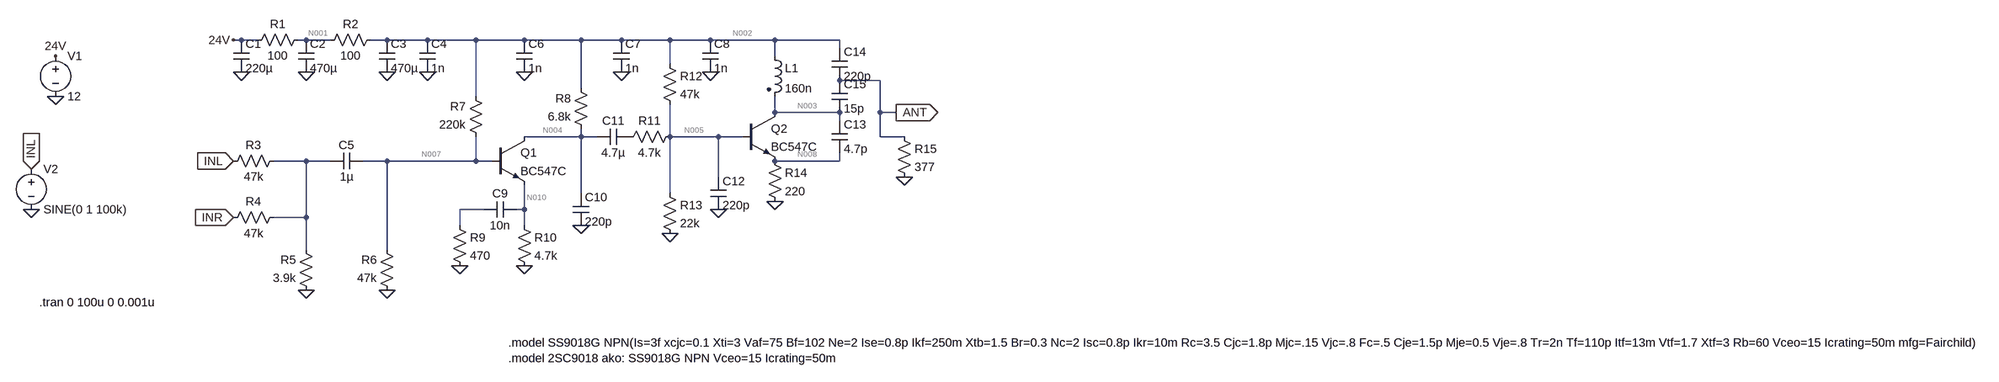
[diagram p0: schematic Sender.asc]
Sender.asc, the LTspice schematic file:
Version 4
SHEET 1 4164 740
WIRE 384 96 368 96
WIRE 416 96 384 96
WIRE 512 96 496 96
WIRE 560 96 512 96
WIRE 672 96 640 96
WIRE 752 96 672 96
WIRE 848 96 752 96
WIRE 944 96 848 96
WIRE 1056 96 944 96
WIRE 1136 96 1056 96
WIRE 1232 96 1136 96
WIRE 1312 96 1232 96
WIRE 1440 96 1312 96
WIRE 1568 96 1440 96
WIRE 1568 112 1568 96
WIRE 1440 128 1440 96
WIRE 1232 144 1232 96
WIRE 1648 176 1568 176
WIRE 1056 192 1056 96
WIRE 848 208 848 96
WIRE 1440 240 1440 208
WIRE 1568 240 1440 240
WIRE 1648 240 1648 176
WIRE 1680 240 1648 240
WIRE 1568 256 1568 240
WIRE 1056 288 1056 272
WIRE 1056 288 944 288
WIRE 1088 288 1056 288
WIRE 1232 288 1232 224
WIRE 1328 288 1232 288
WIRE 1376 288 1328 288
WIRE 1648 288 1648 240
WIRE 1696 288 1648 288
WIRE 512 336 448 336
WIRE 560 336 512 336
WIRE 672 336 624 336
WIRE 848 336 848 288
WIRE 848 336 672 336
WIRE 880 336 848 336
WIRE 1568 336 1568 320
WIRE 1568 336 1440 336
WIRE 1328 368 1328 288
WIRE 1056 400 1056 288
WIRE 1232 400 1232 288
WIRE 864 432 816 432
WIRE 944 432 944 384
WIRE 944 432 928 432
WIRE 512 448 512 336
WIRE 512 448 448 448
WIRE 816 464 816 432
WIRE 944 464 944 432
WIRE 512 512 512 448
WIRE 672 512 672 336
FLAG 16 208 0
FLAG 16 128 24V
FLAG 368 96 24V
FLAG 384 160 0
FLAG 512 160 0
FLAG 672 160 0
FLAG 752 160 0
FLAG 368 336 INL
IOPIN 368 336 In
FLAG 368 448 INR
IOPIN 368 448 In
FLAG 512 592 0
FLAG 672 592 0
FLAG 816 544 0
FLAG 944 544 0
FLAG 1056 464 0
FLAG 944 160 0
FLAG 1136 160 0
FLAG 1312 160 0
FLAG 1232 480 0
FLAG 1328 432 0
FLAG 1440 416 0
FLAG 1680 240 ANT
IOPIN 1680 240 Out
FLAG -32 352 INL
IOPIN -32 352 In
FLAG -32 432 0
FLAG 1696 368 0
SYMBOL voltage 16 112 R0
WINDOW 123 0 0 Left 0
WINDOW 39 0 0 Left 0
SYMATTR InstName V1
SYMATTR Value 12
SYMBOL res 512 80 R90
WINDOW 0 0 56 VBottom 2
WINDOW 3 32 56 VTop 2
SYMATTR InstName R1
SYMATTR Value 100
SYMBOL cap 368 96 R0
SYMATTR InstName C1
SYMATTR Value 220µ
SYMBOL res 656 80 R90
WINDOW 0 0 56 VBottom 2
WINDOW 3 32 56 VTop 2
SYMATTR InstName R2
SYMATTR Value 100
SYMBOL cap 496 96 R0
SYMATTR InstName C2
SYMATTR Value 470µ
SYMBOL cap 656 96 R0
SYMATTR InstName C3
SYMATTR Value 470µ
SYMBOL cap 736 96 R0
SYMATTR InstName C4
SYMATTR Value 1n
SYMBOL res 464 320 R90
WINDOW 0 0 56 VBottom 2
WINDOW 3 32 56 VTop 2
SYMATTR InstName R3
SYMATTR Value 47k
SYMBOL res 464 432 R90
WINDOW 0 0 56 VBottom 2
WINDOW 3 32 56 VTop 2
SYMATTR InstName R4
SYMATTR Value 47k
SYMBOL res 528 608 R180
WINDOW 0 36 76 Left 2
WINDOW 3 36 40 Left 2
SYMATTR InstName R5
SYMATTR Value 3.9k
SYMBOL res 688 608 R180
WINDOW 0 36 76 Left 2
WINDOW 3 36 40 Left 2
SYMATTR InstName R6
SYMATTR Value 47k
SYMBOL res 864 304 R180
WINDOW 0 36 76 Left 2
WINDOW 3 36 40 Left 2
SYMATTR InstName R7
SYMATTR Value 220k
SYMBOL cap 624 320 R90
WINDOW 0 0 32 VBottom 2
WINDOW 3 32 32 VTop 2
SYMATTR InstName C5
SYMATTR Value 1µ
SYMBOL npn 880 288 R0
SYMATTR InstName Q1
SYMATTR Value BC547C
SYMBOL cap 928 96 R0
SYMATTR InstName C6
SYMATTR Value 1n
SYMBOL cap 1120 96 R0
SYMATTR InstName C7
SYMATTR Value 1n
SYMBOL cap 1296 96 R0
SYMATTR InstName C8
SYMATTR Value 1n
SYMBOL res 1072 288 R180
WINDOW 0 36 76 Left 2
WINDOW 3 36 40 Left 2
SYMATTR InstName R8
SYMATTR Value 6.8k
SYMBOL res 800 448 R0
SYMATTR InstName R9
SYMATTR Value 470
SYMBOL res 928 448 R0
SYMATTR InstName R10
SYMATTR Value 4.7k
SYMBOL cap 864 448 R270
WINDOW 0 32 32 VTop 2
WINDOW 3 0 32 VBottom 2
SYMATTR InstName C9
SYMATTR Value 10n
SYMBOL cap 1040 400 R0
SYMATTR InstName C10
SYMATTR Value 220p
SYMBOL cap 1152 272 R90
WINDOW 0 0 32 VBottom 2
WINDOW 3 32 32 VTop 2
SYMATTR InstName C11
SYMATTR Value 4.7µ
SYMBOL res 1248 272 R90
WINDOW 0 0 56 VBottom 2
WINDOW 3 32 56 VTop 2
SYMATTR InstName R11
SYMATTR Value 4.7k
SYMBOL res 1216 128 R0
SYMATTR InstName R12
SYMATTR Value 47k
SYMBOL res 1216 384 R0
SYMATTR InstName R13
SYMATTR Value 22k
SYMBOL cap 1312 368 R0
SYMATTR InstName C12
SYMATTR Value 220p
SYMBOL npn 1376 240 R0
SYMATTR InstName Q2
SYMATTR Value BC547C
SYMBOL res 1424 320 R0
SYMATTR InstName R14
SYMATTR Value 220
SYMBOL cap 1552 256 R0
SYMATTR InstName C13
SYMATTR Value 4.7p
SYMBOL cap 1552 112 R0
SYMATTR InstName C14
SYMATTR Value 220p
SYMBOL cap 1552 176 R0
SYMATTR InstName C15
SYMATTR Value 15p
SYMBOL ind2 1424 112 R0
SYMATTR InstName L1
SYMATTR Value 160n
SYMATTR Type ind
SYMATTR SpiceLine Rser=2
SYMBOL voltage -32 336 R0
WINDOW 123 0 0 Left 0
WINDOW 39 0 0 Left 0
SYMATTR InstName V2
SYMATTR Value SINE(0 1 100k)
SYMBOL res 1680 272 R0
SYMATTR InstName R15
SYMATTR Value 377
TEXT -16 616 Left 2 !.tran 0 100u 0 0.001u
TEXT 912 696 Left 2 !.model SS9018G NPN(Is=3f xcjc=0.1 Xti=3 Vaf=75 Bf=102 Ne=2 Ise=0.8p Ikf=250m Xtb=1.5 Br=0.3 Nc=2 Isc=0.8p Ikr=10m Rc=3.5 Cjc=1.8p Mjc=.15 Vjc=.8 Fc=.5 Cje=1.5p Mje=0.5 Vje=.8 Tr=2n Tf=110p Itf=13m Vtf=1.7 Xtf=3 Rb=60 Vceo=15 Icrating=50m mfg=Fairchild)\n.model 2SC9018 ako: SS9018G NPN Vceo=15 Icrating=50m

The netlist it stands for:
* Sender.asc
V1 24V 0 12
R1 N001 24V 100
C1 24V 0 220µ
R2 N002 N001 100
C2 N001 0 470µ
C3 N002 0 470µ
C4 N002 0 1n
R3 N006 INL 47k
R4 N006 INR 47k
R5 0 N006 3.9k
R6 0 N007 47k
R7 N007 N002 220k
C5 N007 N006 1µ
Q1 N004 N007 N010 0 BC547C
C6 N002 0 1n
C7 N002 0 1n
C8 N002 0 1n
R8 N004 N002 6.8k
R9 N009 0 470
R10 N010 0 4.7k
C9 N009 N010 10n
C10 N004 0 220p
C11 P001 N004 4.7µ
R11 N005 P001 4.7k
R12 N002 N005 47k
R13 N005 0 22k
C12 N005 0 220p
Q2 N003 N005 N008 0 BC547C
R14 N008 0 220
C13 N003 N008 4.7p
C14 N002 ANT 220p
C15 ANT N003 15p
L1 N002 N003 160n Rser=2
V2 INL 0 SINE(0 1 100k)
R15 ANT 0 377
.model NPN NPN
.model PNP PNP
.lib standard.bjt
.tran 0 100u 0 0.001u
.model SS9018G NPN(Is=3f xcjc=0.1 Xti=3 Vaf=75 Bf=102 Ne=2 Ise=0.8p Ikf=250m Xtb=1.5 Br=0.3 Nc=2 Isc=0.8p Ikr=10m Rc=3.5 Cjc=1.8p Mjc=.15 Vjc=.8 Fc=.5 Cje=1.5p Mje=0.5 Vje=.8 Tr=2n Tf=110p Itf=13m Vtf=1.7 Xtf=3 Rb=60 Vceo=15 Icrating=50m mfg=Fairchild)
.model 2SC9018 ako: SS9018G NPN Vceo=15 Icrating=50m
.backanno
.end

* Results of the author's LTspice run, read from the files saved beside the schematic
* Operating Point, zero values left out:
*   V(24v) = 12 V
*   V(n001) = 10.97 V
*   V(n002) = 9.935 V
*   V(n007) = 1.73 V
*   V(n004) = 8.276 V
*   V(n010) = 1.149 V
*   V(p001) = 2.863 V
*   V(n005) = 2.863 V
*   V(n003) = 9.915 V
*   V(n008) = 2.181 V
*   Ic(Q2) = 9.894 mA
*   Ib(Q2) = 20.31 µA
*   Ie(Q2) = -9.914 mA
*   Ic(Q1) = 243.9 µA
*   Ib(Q1) = 478.4 nA
*   Ie(Q1) = -244.4 µA
*   I(L1) = 9.894 mA
*   I(R14) = 9.914 mA
*   I(R13) = 130.1 µA
*   I(R12) = 150.5 µA
*   I(R10) = 244.4 µA
*   I(R8) = -243.9 µA
*   I(R7) = -37.29 µA
*   I(R6) = -36.82 µA
*   I(R2) = -10.33 mA
*   I(R1) = -10.33 mA
*   I(V1) = -10.33 mA